# Altium schematic sheet 13_PHY_FE_33-40.SchDoc
size 419 x 296 mm; Author: Serbinov O.A.; CompanyName: ELSICOM; DrawnBy: Serbinov O.A.; Engineer: Serbinov O.A.; Organization: Elsicom; Address1: Kirova avenue, 58; Address2: Tomsk; Address3: Russia 634012; DocumentNumber: 14; SheetNumber: 14; SheetTotal: 44; ProjectName: 48_PORTS
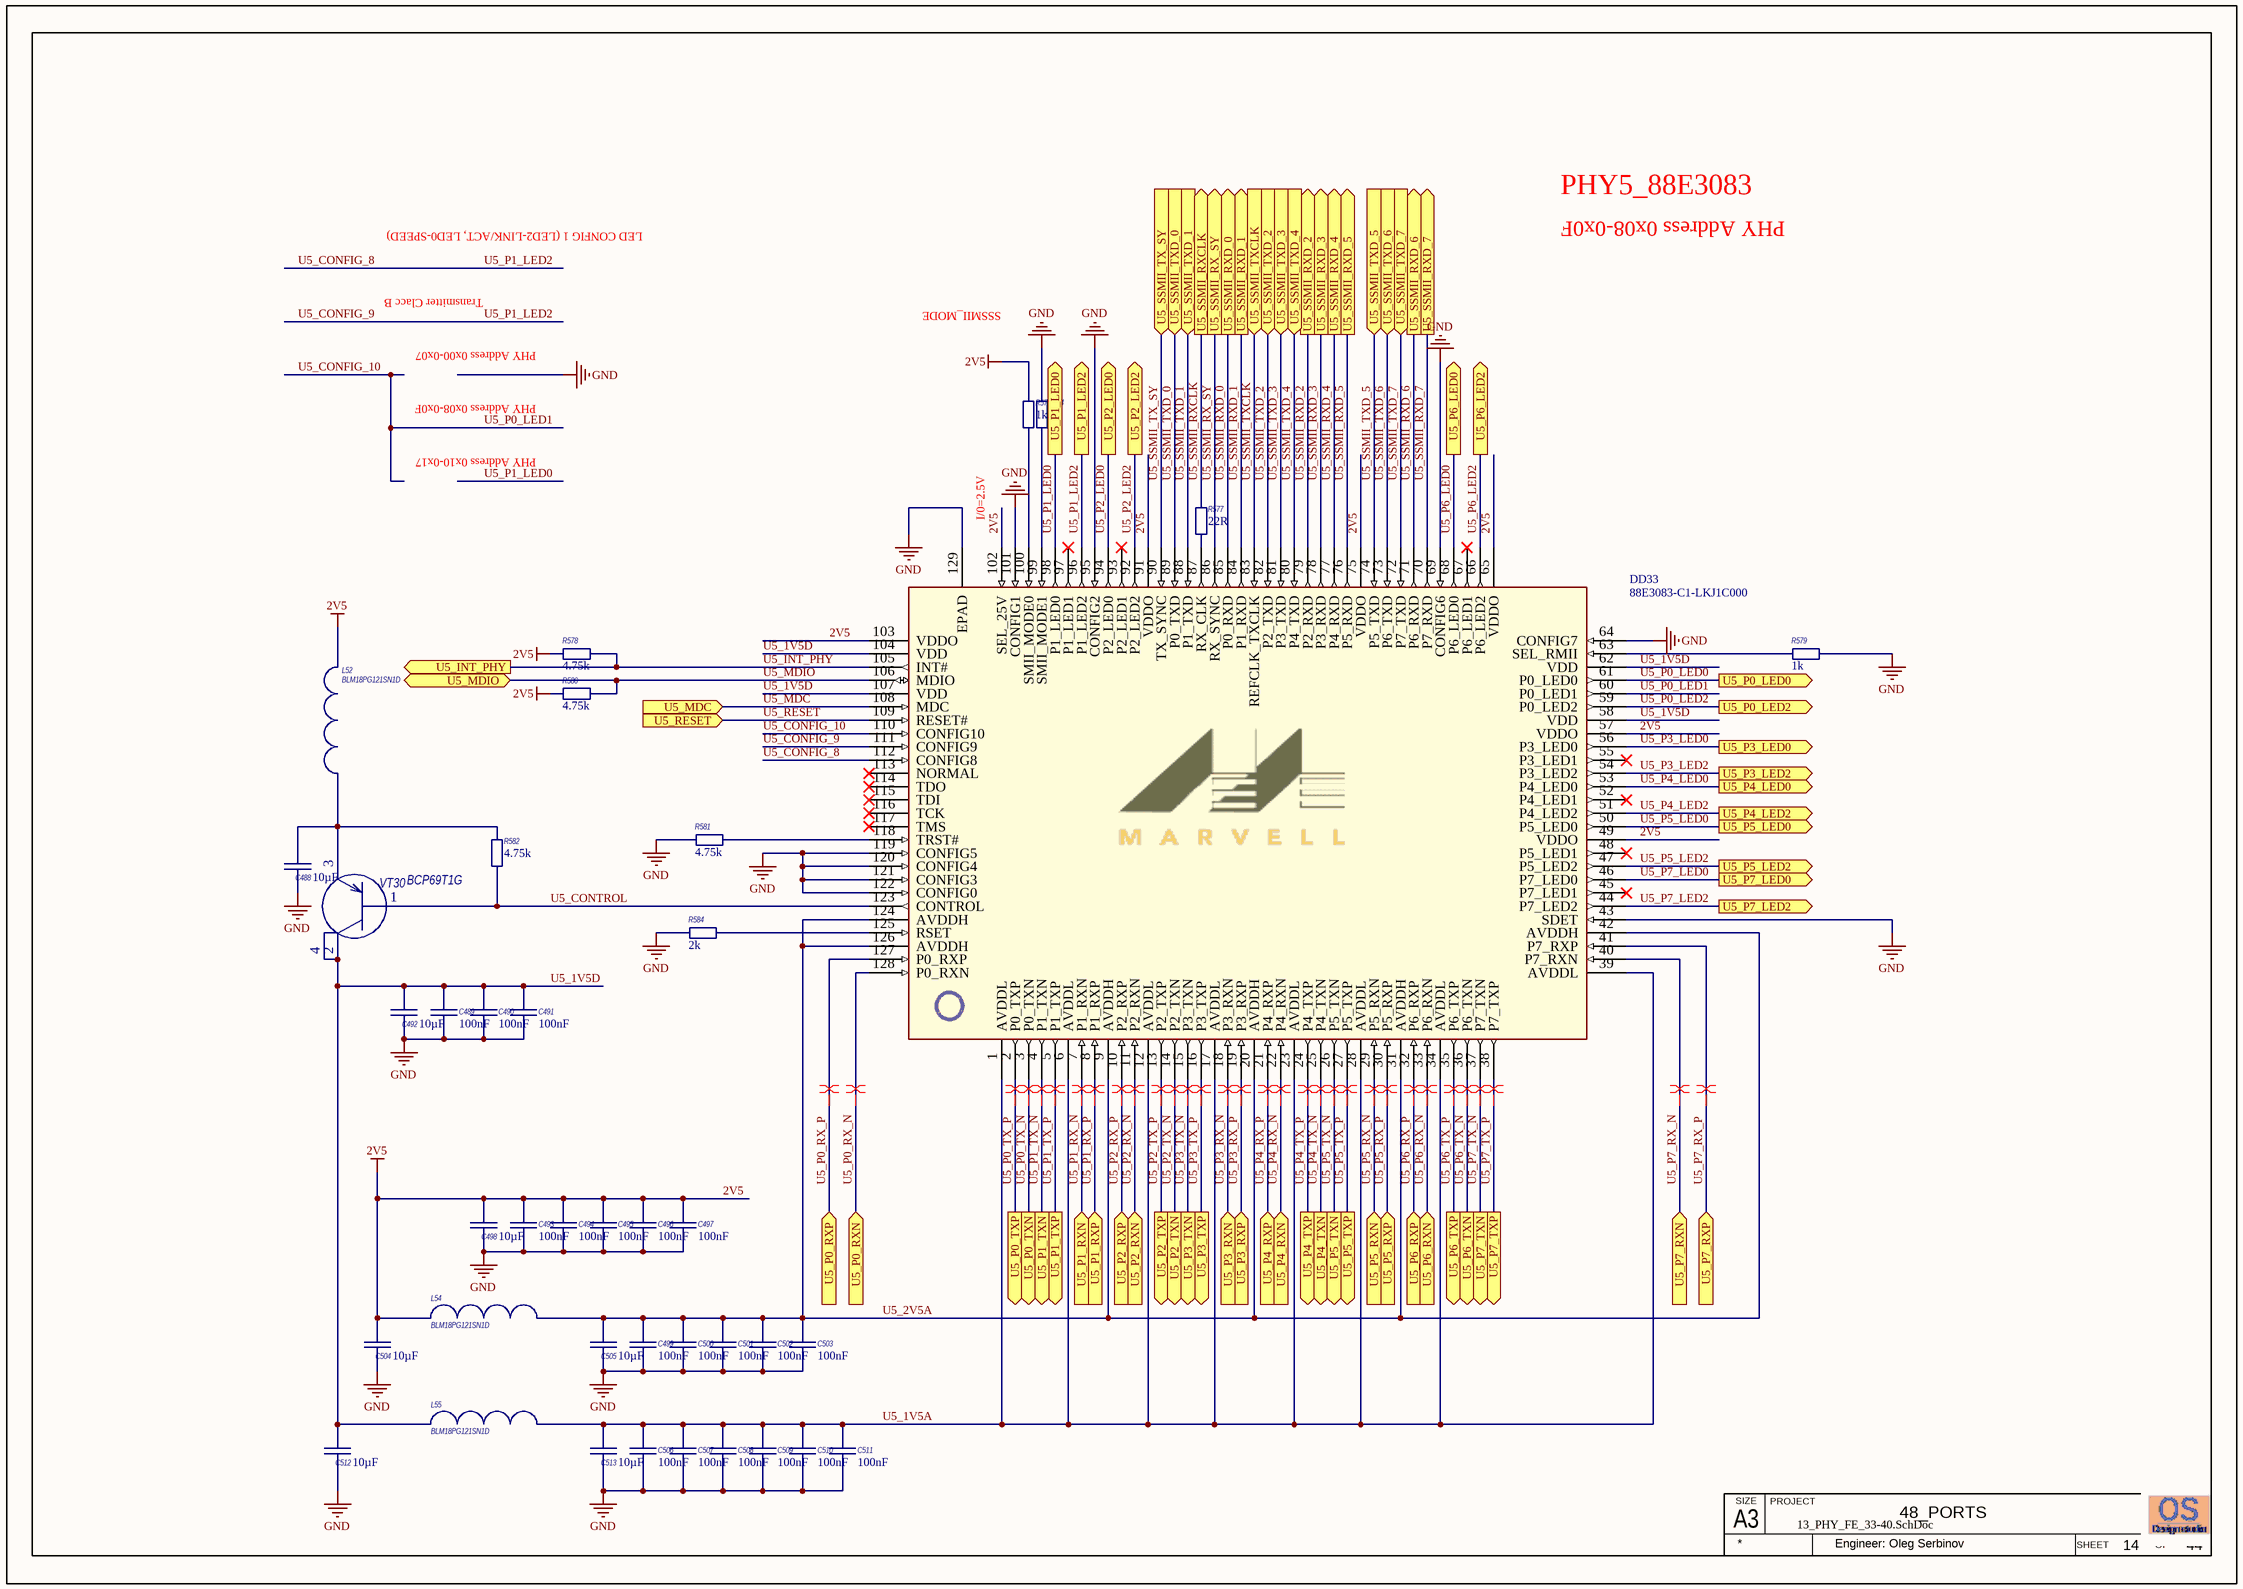
[diagram p0: 13_PHY_FE_33-40.SchDoc]

## Parts
C488  Capacitance: 10µF  [CAPC2012[0805]]  (hidden comment: GRM21BR61C106KE15)
C489  Capacitance: 100nF  [C0402_IPC High Density]  (hidden comment: GRM155R71E104KE14D)
C490  Capacitance: 100nF  [C0402_IPC High Density]  (hidden comment: GRM155R71E104KE14D)
C491  Capacitance: 100nF  [C0402_IPC High Density]  (hidden comment: GRM155R71E104KE14D)
C492  Capacitance: 10µF  [CAPC2012[0805]]  (hidden comment: GRM21BR61C106KE15)
C493  Capacitance: 100nF  [C0402_IPC High Density]  (hidden comment: GRM155R71E104KE14D)
C494  Capacitance: 100nF  [C0402_IPC High Density]  (hidden comment: GRM155R71E104KE14D)
C495  Capacitance: 100nF  [C0402_IPC High Density]  (hidden comment: GRM155R71E104KE14D)
C496  Capacitance: 100nF  [C0402_IPC High Density]  (hidden comment: GRM155R71E104KE14D)
C497  Capacitance: 100nF  [C0402_IPC High Density]  (hidden comment: GRM155R71E104KE14D)
C498  Capacitance: 10µF  [CAPC2012[0805]]  (hidden comment: GRM21BR61C106KE15)
C499  Capacitance: 100nF  [C0402_IPC High Density]  (hidden comment: GRM155R71E104KE14D)
C500  Capacitance: 100nF  [C0402_IPC High Density]  (hidden comment: GRM155R71E104KE14D)
C501  Capacitance: 100nF  [C0402_IPC High Density]  (hidden comment: GRM155R71E104KE14D)
C502  Capacitance: 100nF  [C0402_IPC High Density]  (hidden comment: GRM155R71E104KE14D)
C503  Capacitance: 100nF  [C0402_IPC High Density]  (hidden comment: GRM155R71E104KE14D)
C504  Capacitance: 10µF  [CAPC2012[0805]]  (hidden comment: GRM21BR61C106KE15)
C505  Capacitance: 10µF  [CAPC2012[0805]]  (hidden comment: GRM21BR61C106KE15)
C506  Capacitance: 100nF  [C0402_IPC High Density]  (hidden comment: GRM155R71E104KE14D)
C507  Capacitance: 100nF  [C0402_IPC High Density]  (hidden comment: GRM155R71E104KE14D)
C508  Capacitance: 100nF  [C0402_IPC High Density]  (hidden comment: GRM155R71E104KE14D)
C509  Capacitance: 100nF  [C0402_IPC High Density]  (hidden comment: GRM155R71E104KE14D)
C510  Capacitance: 100nF  [C0402_IPC High Density]  (hidden comment: GRM155R71E104KE14D)
C511  Capacitance: 100nF  [C0402_IPC High Density]  (hidden comment: GRM155R71E104KE14D)
C512  Capacitance: 10µF  [CAPC2012[0805]]  (hidden comment: GRM21BR61C106KE15)
C513  Capacitance: 10µF  [CAPC2012[0805]]  (hidden comment: GRM21BR61C106KE15)
DD33  88E3083-C1-LKJ1C000  [LQFP-128N]
L52  BLM18PG121SN1D  [INDC1608X95N]
L54  BLM18PG121SN1D  [INDC1608X95N]
L55  BLM18PG121SN1D  [INDC1608X95N]
R573  Resistance: 1k  [R0402_IPC High Density]  (hidden comment: ERJ-2RKF1001X)
R574  Resistance: 1k  [R0402_IPC High Density]  (hidden comment: ERJ-2RKF1001X)
R577  Resistance: 22R  [R0402_IPC High Density]  (hidden comment: ERJ-2RKF22R0X)
R578  Resistance (Ohms): 4.75k  [R0402_IPC High Density]  (hidden comment: ERJ-2RKF4751X)
R579  Resistance: 1k  [R0402_IPC High Density]  (hidden comment: ERJ-2RKF1001X)
R580  Resistance (Ohms): 4.75k  [R0402_IPC High Density]  (hidden comment: ERJ-2RKF4751X)
R581  Resistance (Ohms): 4.75k  [R0402_IPC High Density]  (hidden comment: ERJ-2RKF4751X)
R582  Resistance (Ohms): 4.75k  [R0402_IPC High Density]  (hidden comment: ERJ-2RKF4751X)
R584  Resistance (Ohms): 2k  [R0402_IPC High Density]  (hidden comment: ERJ-2RKF2001X)
VT30  BCP69T1G  [SOT223_N]

## Ports
U5_INT_PHY (out), U5_MDC (in), U5_MDIO (bidir), U5_P0_LED0 (out), U5_P0_LED2 (out), U5_P0_RXN (in), U5_P0_RXP (in), U5_P0_TXN (out), U5_P0_TXP (out), U5_P1_LED0 (out), U5_P1_LED2 (out), U5_P1_RXN (in), U5_P1_RXP (in), U5_P1_TXN (out), U5_P1_TXP (out), U5_P2_LED0 (out), U5_P2_LED2 (out), U5_P2_RXN (in), U5_P2_RXP (in), U5_P2_TXN (out), U5_P2_TXP (out), U5_P3_LED0 (out), U5_P3_LED2 (out), U5_P3_RXN (in), U5_P3_RXP (in), U5_P3_TXN (out), U5_P3_TXP (out), U5_P4_LED0 (out), U5_P4_LED2 (out), U5_P4_RXN (in), U5_P4_RXP (in), U5_P4_TXN (out), U5_P4_TXP (out), U5_P5_LED0 (out), U5_P5_LED2 (out), U5_P5_RXN (in), U5_P5_RXP (in), U5_P5_TXN (out), U5_P5_TXP (out), U5_P6_LED0 (out), U5_P6_LED2 (out), U5_P6_RXN (in), U5_P6_RXP (in), U5_P6_TXN (out), U5_P6_TXP (out), U5_P7_LED0 (out), U5_P7_LED2 (out), U5_P7_RXN (in), U5_P7_RXP (in), U5_P7_TXN (out), U5_P7_TXP (out), U5_RESET (in), U5_SSMII_RX_SY (out), U5_SSMII_RXCLK (out), U5_SSMII_RXD_0 (out), U5_SSMII_RXD_1 (out), U5_SSMII_RXD_2 (out), U5_SSMII_RXD_3 (out), U5_SSMII_RXD_4 (out), U5_SSMII_RXD_5 (out), U5_SSMII_RXD_6 (out), U5_SSMII_RXD_7 (out), U5_SSMII_TX_SY (in), U5_SSMII_TXCLK (in), U5_SSMII_TXD_0 (in), U5_SSMII_TXD_1 (in), U5_SSMII_TXD_2 (in), U5_SSMII_TXD_3 (in), U5_SSMII_TXD_4 (in), U5_SSMII_TXD_5 (in), U5_SSMII_TXD_6 (in), U5_SSMII_TXD_7 (in)

## Nets
2V5: C493.2 C494.2 C495.2 C496.2 C497.2 C498.2 C504.2 DD33.49(VDDO) DD33.57(VDDO) DD33.65(VDDO) DD33.75(VDDO) DD33.91(VDDO) DD33.102(SEL_25V) DD33.103(VDDO) L52.2 L54.1 R573.2 R578.1 R580.1
GND: C488.1 C489.1 C490.1 C491.1 C492.1 C493.1 C494.1 C495.1 C496.1 C497.1 C498.1 C499.1 C500.1 C501.1 C502.1 C503.1 C504.1 C505.1 C506.1 C507.1 C508.1 C509.1 C510.1 C511.1 C512.1 C513.1 DD33.43(SDET) DD33.64(CONFIG7) DD33.69(CONFIG6) DD33.95(CONFIG2) DD33.101(CONFIG1) DD33.119(CONFIG5) DD33.120(CONFIG4) DD33.121(CONFIG3) DD33.122(CONFIG0) DD33.129(EPAD) R574.2 R579.1 R581.1 R584.1
U5_1V5A: C506.2 C507.2 C508.2 C509.2 C510.2 C511.2 C513.2 DD33.1(AVDDL) DD33.6(AVDDL) DD33.12(AVDDL) DD33.17(AVDDL) DD33.23(AVDDL) DD33.28(AVDDL) DD33.34(AVDDL) DD33.39(AVDDL) L55.2
U5_1V5D: C489.2 C490.2 C491.2 C492.2 C512.2 DD33.58(VDD) DD33.62(VDD) DD33.104(VDD) DD33.107(VDD) L55.1 VT30.2(K) VT30.4(K)
U5_2V5A: C499.2 C500.2 C501.2 C502.2 C503.2 C505.2 DD33.9(AVDDH) DD33.20(AVDDH) DD33.31(AVDDH) DD33.42(AVDDH) DD33.124(AVDDH) DD33.126(AVDDH) L54.2
U5_CONFIG_8: DD33.96(P1_LED2) DD33.111(CONFIG9) DD33.112(CONFIG8) ; port U5_P1_LED2  [also labelled U5_CONFIG_9, U5_P1_LED2]
U5_CONFIG_10: DD33.60(P0_LED1) DD33.110(CONFIG10)  [also labelled U5_P0_LED1]
U5_CONTROL: DD33.123(CONTROL) R582.1 VT30.1(B)
U5_INT_PHY: DD33.105(INT#) R578.2 ; port U5_INT_PHY
U5_MDC: DD33.108(MDC) ; port U5_MDC
U5_MDIO: DD33.106(MDIO) R580.2 ; port U5_MDIO
U5_P0_LED0: DD33.61(P0_LED0) ; port U5_P0_LED0
U5_P0_LED2: DD33.59(P0_LED2) ; port U5_P0_LED2
U5_P0_RX_N: DD33.128(P0_RXN) ; port U5_P0_RXN
U5_P0_RX_P: DD33.127(P0_RXP) ; port U5_P0_RXP
U5_P0_TX_N: DD33.3(P0_TXN) ; port U5_P0_TXN
U5_P0_TX_P: DD33.2(P0_TXP) ; port U5_P0_TXP
U5_P1_LED0: DD33.98(P1_LED0) ; port U5_P1_LED0
U5_P1_RX_N: DD33.7(P1_RXN) ; port U5_P1_RXN
U5_P1_RX_P: DD33.8(P1_RXP) ; port U5_P1_RXP
U5_P1_TX_N: DD33.4(P1_TXN) ; port U5_P1_TXN
U5_P1_TX_P: DD33.5(P1_TXP) ; port U5_P1_TXP
U5_P2_LED0: DD33.94(P2_LED0) ; port U5_P2_LED0
U5_P2_LED2: DD33.92(P2_LED2) ; port U5_P2_LED2
U5_P2_RX_N: DD33.11(P2_RXN) ; port U5_P2_RXN
U5_P2_RX_P: DD33.10(P2_RXP) ; port U5_P2_RXP
U5_P2_TX_N: DD33.14(P2_TXN) ; port U5_P2_TXN
U5_P2_TX_P: DD33.13(P2_TXP) ; port U5_P2_TXP
U5_P3_LED0: DD33.56(P3_LED0) ; port U5_P3_LED0
U5_P3_LED2: DD33.54(P3_LED2) ; port U5_P3_LED2
U5_P3_RX_N: DD33.18(P3_RXN) ; port U5_P3_RXN
U5_P3_RX_P: DD33.19(P3_RXP) ; port U5_P3_RXP
U5_P3_TX_N: DD33.15(P3_TXN) ; port U5_P3_TXN
U5_P3_TX_P: DD33.16(P3_TXP) ; port U5_P3_TXP
U5_P4_LED0: DD33.53(P4_LED0) ; port U5_P4_LED0
U5_P4_LED2: DD33.51(P4_LED2) ; port U5_P4_LED2
U5_P4_RX_N: DD33.22(P4_RXN) ; port U5_P4_RXN
U5_P4_RX_P: DD33.21(P4_RXP) ; port U5_P4_RXP
U5_P4_TX_N: DD33.25(P4_TXN) ; port U5_P4_TXN
U5_P4_TX_P: DD33.24(P4_TXP) ; port U5_P4_TXP
U5_P5_LED0: DD33.50(P5_LED0) ; port U5_P5_LED0
U5_P5_LED2: DD33.47(P5_LED2) ; port U5_P5_LED2
U5_P5_RX_N: DD33.29(P5_RXN) ; port U5_P5_RXN
U5_P5_RX_P: DD33.30(P5_RXP) ; port U5_P5_RXP
U5_P5_TX_N: DD33.26(P5_TXN) ; port U5_P5_TXN
U5_P5_TX_P: DD33.27(P5_TXP) ; port U5_P5_TXP
U5_P6_LED0: DD33.68(P6_LED0) ; port U5_P6_LED0
U5_P6_LED2: DD33.66(P6_LED2) ; port U5_P6_LED2
U5_P6_RX_N: DD33.33(P6_RXN) ; port U5_P6_RXN
U5_P6_RX_P: DD33.32(P6_RXP) ; port U5_P6_RXP
U5_P6_TX_N: DD33.36(P6_TXN) ; port U5_P6_TXN
U5_P6_TX_P: DD33.35(P6_TXP) ; port U5_P6_TXP
U5_P7_LED0: DD33.46(P7_LED0) ; port U5_P7_LED0
U5_P7_LED2: DD33.44(P7_LED2) ; port U5_P7_LED2
U5_P7_RX_N: DD33.40(P7_RXN) ; port U5_P7_RXN
U5_P7_RX_P: DD33.41(P7_RXP) ; port U5_P7_RXP
U5_P7_TX_N: DD33.37(P7_TXN) ; port U5_P7_TXN
U5_P7_TX_P: DD33.38(P7_TXP) ; port U5_P7_TXP
U5_RESET: DD33.109(RESET#) ; port U5_RESET
U5_SSMII_RX_SY: DD33.86(RX_SYNC) ; port U5_SSMII_RX_SY
U5_SSMII_RXCLK: R577.2 ; port U5_SSMII_RXCLK
U5_SSMII_RXD_0: DD33.85(P0_RXD) ; port U5_SSMII_RXD_0
U5_SSMII_RXD_1: DD33.84(P1_RXD) ; port U5_SSMII_RXD_1
U5_SSMII_RXD_2: DD33.79(P2_RXD) ; port U5_SSMII_RXD_2
U5_SSMII_RXD_3: DD33.78(P3_RXD) ; port U5_SSMII_RXD_3
U5_SSMII_RXD_4: DD33.77(P4_RXD) ; port U5_SSMII_RXD_4
U5_SSMII_RXD_5: DD33.76(P5_RXD) ; port U5_SSMII_RXD_5
U5_SSMII_RXD_6: DD33.71(P6_RXD) ; port U5_SSMII_RXD_6
U5_SSMII_RXD_7: DD33.70(P7_RXD) ; port U5_SSMII_RXD_7
U5_SSMII_TX_SY: DD33.90(TX_SYNC) ; port U5_SSMII_TX_SY
U5_SSMII_TXCLK: DD33.83(REFCLK_TXCLK) ; port U5_SSMII_TXCLK
U5_SSMII_TXD_0: DD33.89(P0_TXD) ; port U5_SSMII_TXD_0
U5_SSMII_TXD_1: DD33.88(P1_TXD) ; port U5_SSMII_TXD_1
U5_SSMII_TXD_2: DD33.82(P2_TXD) ; port U5_SSMII_TXD_2
U5_SSMII_TXD_3: DD33.81(P3_TXD) ; port U5_SSMII_TXD_3
U5_SSMII_TXD_4: DD33.80(P4_TXD) ; port U5_SSMII_TXD_4
U5_SSMII_TXD_5: DD33.74(P5_TXD) ; port U5_SSMII_TXD_5
U5_SSMII_TXD_6: DD33.73(P6_TXD) ; port U5_SSMII_TXD_6
U5_SSMII_TXD_7: DD33.72(P7_TXD) ; port U5_SSMII_TXD_7
NetC488_2: C488.2 L52.1 R582.2 VT30.3(E)
NetDD33_63: DD33.63(SEL_RMII) R579.2
NetDD33_87: DD33.87(RX_CLK) R577.1
NetDD33_99: DD33.99(SMII_MODE1) R574.1
NetDD33_100: DD33.100(SMII_MODE0) R573.1
NetDD33_118: DD33.118(TRST#) R581.2
NetDD33_125: DD33.125(RSET) R584.2

Not connected (* = marked no-connect by the designer): DD33 45(P7_LED1)* 48(P5_LED1)* 52(P4_LED1)* 55(P3_LED1)* 67(P6_LED1)* 93(P2_LED1)* 97(P1_LED1)* 113(NORMAL)* 114(TDO)* 115(TDI)* 116(TCK)* 117(TMS)*

## Layout directives
differential pair: U5_P0_RX_N, U5_P0_RX_P, U5_P0_TX_N, U5_P0_TX_P, U5_P1_RX_N, U5_P1_RX_P, U5_P1_TX_N, U5_P1_TX_P, U5_P2_RX_N, U5_P2_RX_P, U5_P2_TX_N, U5_P2_TX_P, U5_P3_RX_N, U5_P3_RX_P, U5_P3_TX_N, U5_P3_TX_P, U5_P4_RX_N, U5_P4_RX_P, U5_P4_TX_N, U5_P4_TX_P, U5_P5_RX_N, U5_P5_RX_P, U5_P5_TX_N, U5_P5_TX_P, U5_P6_RX_N, U5_P6_RX_P, U5_P6_TX_N, U5_P6_TX_P, U5_P7_RX_N, U5_P7_RX_P, U5_P7_TX_N, U5_P7_TX_P

## Notes on the sheet
- LED CONFIG 1 (LED2-LINK/ACT, LED0-SPEED)
- PHY5_88E3083
- PHY Address 0x08-0x0F
- Transmitter Clacc B
- SSSMII_MODE
- PHY Address 0x00-0x07
- PHY Address 0x10-0x17
- I/0=2.5V
- A3
- SIZE
- PROJECT
- SHEET
- OF
- Engineer: Oleg Serbinov

## Library data of the parts
C488 C492 C498 C504 C505 C512 C513 = GRM21BR61C106KE15: C0805, 10uF 10%, 16V, X5R; Manufacturer: Murata; Customer Part Number: Конденсатор, 10u, 0805, 16V, X5R, 10%; Analogs: any suitable; Applications: General Purpose; Category: Capacitors; Operating Temperature: -55°C ~ 85°C; Package / Case: 0805 (2012 Metric); Size / Dimension: 0.079" L x 0.049" W (2.00mm x 1.25mm); Temperature Coefficient: X5R; Tolerance: ±10%; ComponentLink1URL: http://search.murata.co.jp/Ceramy/image/img/PDF/ENG/GRM21BR61C106KE15.pdf; ComponentLink1Description: http://search.murata.co.jp/Ceramy/image/img/PDF/ENG/GRM21BR61C106KE15.pdf; Pricing: 1=0.3, 10=0.25, 50=0.1408, 100=0.1252, 250=0.09392, 500=0.08294, 1000=0.07356 (USD); Voltage - Rated: 16V; Manufacturer Part Number: GRM21BR61C106KE15
C489-C491 C493-C497 C499-C503 C506-C511 = GRM155R71E104KE14D: C0402, 100nF, 25V, X7R; Manufacturer: Murata; Rmanufacturer: Yageo  Samsung  TDK  Taiyo Yuden  Kemet; Customer Part Number: Конденсатор, 100n, 0402, 25V, X7R, 10%; Capacitance Tolerance: ± 10%; Voltage Rating: 16; Capacitor Case Style: 0402 [1005 Metric]; Capacitor Terminals: SMD; SVHC: No SVHC (19-Dec-2012); No. of Pins: 2; Reel Quantity: 10000; Tolerance +: 10%; Analogs: any suitable; Supplier 1: Farnell; Supplier Part Number 1: 1118151; Manufacturer Part Number: GRM155R71E104KE14D; RoHS: YES; Stock: 3; Pricing: 10000=0.008593, 30000=0.007991 (GBP); Dielectric Characteristic: X7R; Operating Temperature Min: -55; Operating Temperature Max: 125; Operating Temperature Range: -55°C to +125; Package / Case: 0402; Packaging: Reel; Series: GRM Hi-Cap; Terminal Type: Surface Mount (SMD, SMT); Tolerance -: 10%; Voltage Rating V DC: 16; ComponentLink1URL: http://www.farnell.com/datasheets/4360.pdf; ComponentLink1Description: http://www.farnell.com/datasheets/4360.pdf
DD33 = 88E3083-C1-LKJ1C000: IC 10/100BASE-T OCTAL PHY; Customer Part Number: Микросхема, 88E3083-C1-LKJ1C000, IC 10/100BASE-T OCTAL PHY, 128 LQFP; Manufacturer: Marvell Technology Group; Manufacturer Part Number: 88E3083-C1-LKJ1C000
L52 L54 L55 = BLM18PG121SN1D: FILTER BLM18 (0603, 2A); Manufacturer: Murata; Rpart number: MPZ1608S121ATAH0 ; CIC10P121NC ; MPZ1608S121ATDH5 ; BLM18PG121SH1D ; 742792625; Rmanufacturer: Boruns  Samsung  TDK  Murata  Wurth Electronics; Customer Part Number: Дроссель, BLM18PG121SN1D, FERRITE BEAD 120 OHM 1LN, 0603; DC Resistance Max: 0.05; Impedance: 120; Ferrite Mounting: SMD; Inductor Type: Ferrite Bead; SVHC: No SVHC (19-Dec-2011); Ferrite Case Style: 0603 / 1608; Core Material: Ferrite; DC Current Max: 2000; Inductor Case Style: 0603; Inductance Tolerance: ± 25%; No. of Pins: 2; RoHS: YES; Operating Temperature Min: -55; Mounting Type: SMD; Operating Temperature Max: +125; Package / Case: 0603; Impedance @ 100MHz Typ: 120; Resistance: 0.05; Supplier Part Number: 1515738; Supplier: Farnell; ComponentLink1URL: http://www.farnell.com/datasheets/5148.pdf; ComponentLink1Description: http://www.farnell.com/datasheets/5148.pdf; Pricing: 5=0.056, 50=0.041, 100=0.034, 250=0.028, 500=0.027 (GBP); Manufacturer Part Number: BLM18PG121SN1D; DC Current Rating: 2A; Analogs: MPZ1608S121ATAH0 ; CIC10P121NC ; MPZ1608S121ATDH5 ; BLM18PG121SH1D ; 742792625
R573 R574 R579 = ERJ-2RKF1001X: R0402, 1k 1%; Manufacturer: Panasonic; Rpart number: RC0402FR-071KL ; RC1005F102CS ; RMCF0402FT1K00 ; MCR01MRTF1001 ; CRCW04021K00FKED ; ERJ2RKF1001X; Rmanufacturer: Yageo  Samsung  Stackpole Electronics  Rohm Semiconductor  Vishay Dale; Customer Part Number: Резистор, 1K, 0402, 1%; Temperature Coefficient: 100 PPM / C; Power Rating: 100 mWatts; Voltage Rating: 50 Volts; Analogs: any suitable; Supplier: Mouser; Termination Style: SMD/SMT; Series: ERJ; Supplier Part Number: 667-ERJ-2RKF1001X; RoHS: RoHS Compliant By Exemption; Dimensions: 0.5 mm W x 1 mm L x 0.35 mm H; Package / Case: 0402 (1005 metric); Product Category: .; Manufacturer Part Number: ERJ-2RKF1001X; Packaging: Reel; Tolerance: 1 %; Operating Temperature Range: - 55 C to + 155 C; Category: Thick Film Resistors - SMD; Product: Thick Film Resistors SMD; Reeling: True; Minimum Order Quantity: 1; RoHS - Mouser: E; Standard Pack Qty: 10000; ComponentLink1URL: http://industrial.panasonic.com/www-data/pdf/AOA0000/AOA0000CE2.pdf; ComponentLink1Description: http://industrial.panasonic.com/www-data/pdf/AOA0000/AOA0000CE2.pdf; Pricing: 1=0.135, 25=0.032, 100=0.024, 250=0.018, 500=0.014, 1000=0.008, 2000=0.007, 5000=0.004 (AUD)
R577 = ERJ-2RKF22R0X: R0402, 22R 1%; Manufacturer: Panasonic; Rpart number: RC0402FR-0749R9L ; RC1005F49R9CS ; MCR01MRTF49R9 ; CRCW040249R9FKED ; CR0402-FX-49R9GLF ; RC-02W220FT; Rmanufacturer: Yageo  Samsung  Stackpole Electronics  Rohm Semiconductor  Vishay Dale; Customer Part Number: Резистор, 22R, 0402, 1%; Power Rating: 100; Voltage Rating: 50; Temperature Coefficient: ± 100; Resistor Element Material: Thick Film; Resistor Case Style: 0402; Resistor Mounting: SMD; Analogs: any suitable; Supplier 1: Farnell; Supplier Part Number 1: 2059106; RoHS 1: YES; Stock 1: 10948; Pricing 1: 50=0.016, 100=0.012, 500=0.006, 1000=0.004 (GBP); Resistance Tolerance: ± 1%; ComponentLink1URL: http://www.farnell.com/datasheets/426256.pdf; ComponentLink1Description: http://www.farnell.com/datasheets/426256.pdf; Supplier: Farnell; RoHS: YES; Manufacturer Part Number: ERJ-2RKF22R0X; Supplier Part Number: 2059106; Pricing: 50=0.016, 100=0.012, 500=0.006, 1000=0.004 (GBP)
R578 R580-R582 = ERJ-2RKF4751X: R0402, 4.75k 1%; Manufacturer: Panasonic; Rpart number: RC0402FR-074K75L ; RC1005F4751CS ; RMCF0402FT4K75 ; CRCW04024K75FKED ; TRR01MZPF4751; Rmanufacturer: Yageo  Samsung  Stackpole Electronics  Rohm Semiconductor  Vishay Dale; Customer Part Number: Резистор, 4K75, 0402, 1%; Temperature Coefficient: ±100ppm/°C; Power (Watts): 0.1W, 1/10W; Analogs: any suitable; Tolerance: ±1%; Packaging: Cut Tape (CT); Package / Case: 0402 (1005 Metric); Category: Resistors; Manufacturer Part Number: ERJ-2RKF4751X; Supplier Part Number: P4.75KLCT-ND; RoHS: RoHS Compliant; Supplier: Digi-Key; ComponentLink1URL: http://industrial.panasonic.com/www-cgi/jvcr13pz.cgi?E+PZ+3+AOA0002+ERJ2RKF4751X+7+WW; ComponentLink1Description: http://industrial.panasonic.com/www-cgi/jvcr13pz.cgi?E+PZ+3+AOA0002+ERJ2RKF4751X+7+WW; Features: -; Composition: Thick Film; Height: 0.016" (0.40mm); Number of Terminations: 2; Supplier Device Package: 0402; Size / Dimension: 0.039" L x 0.020" W (1.00mm x 0.50mm)
R584 = ERJ-2RKF2001X: R0402, 2k 1%; Manufacturer: Panasonic; Customer Part Number: Резистор, 2K, 0402, 1%; Temperature Coefficient: ±100ppm/°C; Power (Watts): 0.1W, 1/10W; Analogs: any suitable; Tolerance: ±1%; Package / Case: 0402 (1005 Metric); Features: -; Height: 0.016" (0.40mm); Size / Dimension: 0.039" L x 0.020" W (1.00mm x 0.50mm); Category: Resistors; Supplier: Digi-Key; Composition: Thick Film; RoHS: RoHS Compliant; Supplier Part Number: P2.00KLTR-ND; Manufacturer Part Number: ERJ-2RKF2001X; Packaging: Tape & Reel (TR); Number of Terminations: 2; ComponentLink1URL: http://industrial.panasonic.com/www-cgi/jvcr13pz.cgi?E+PZ+3+AOA0002+ERJ2RKF2001X+7+WW; ComponentLink1Description: http://industrial.panasonic.com/www-cgi/jvcr13pz.cgi?E+PZ+3+AOA0002+ERJ2RKF2001X+7+WW; Pricing: 10000=0.00347, 30000=0.00305, 50000=0.00279, 100000=0.00274 (USD)
VT30 = BCP69T1: TRANSISTOR PNP -20V -1A SOT-223; Manufacturer: ON Semiconductor; Rpart number: FZT549TA; Rmanufacturer: Diodes Incorporated; Customer Part Number: Транзистор, BCP69T1G, TRANS PNP 20V 1A, SOT-223; Description 1: Transistors Bipolar - BJT 1A 20V PNP; Category 1: Transistors Bipolar - BJT; Collector- Emitter Voltage VCEO Max: 20 V; Configuration: Single; Emitter- Base Voltage VEBO: 5 V; Power Dissipation: 1.5 W; DC Collector/Base Gain hfe Min: 50 at 5 mA at 10 V; Maximum DC Collector Current: 1 A; Maximum Operating Frequency: 60 MHz; Product Status: Obsolete; Supplier 1: Mouser; Supplier Part Number 1: 863-BCP69T1; RoHS 1: RoHS Compliant; Stock 1: 0; Package / Case: SOT-223-4; Packaging: Reel; Continuous Collector Current: - 1 A; Mounting Style: SMD/SMT; Transistor Polarity: PNP; Maximum Operating Temperature: + 150 C; Minimum Operating Temperature: - 65 C; Product Category: Transistors Bipolar- General Purpose; Standard Pack Qty: 1000; RoHS - Mouser: N; Minimum Order Quantity: 1; Reeling: True; ComponentLink1URL: http://www.onsemi.com/pub/Collateral/BCP69T1-D.PDF; ComponentLink1Description: http://www.onsemi.com/pub/Collateral/BCP69T1-D.PDF; RoHS: RoHS Compliant; Supplier Part Number: 863-BCP69T1; Manufacturer Part Number: BCP69T1; Supplier: Mouser; Category: Transistors Bipolar - BJT; Analogs: FZT549TA